# EAGLE schematic Super Skiff Power (EAGLE 8.2.2)
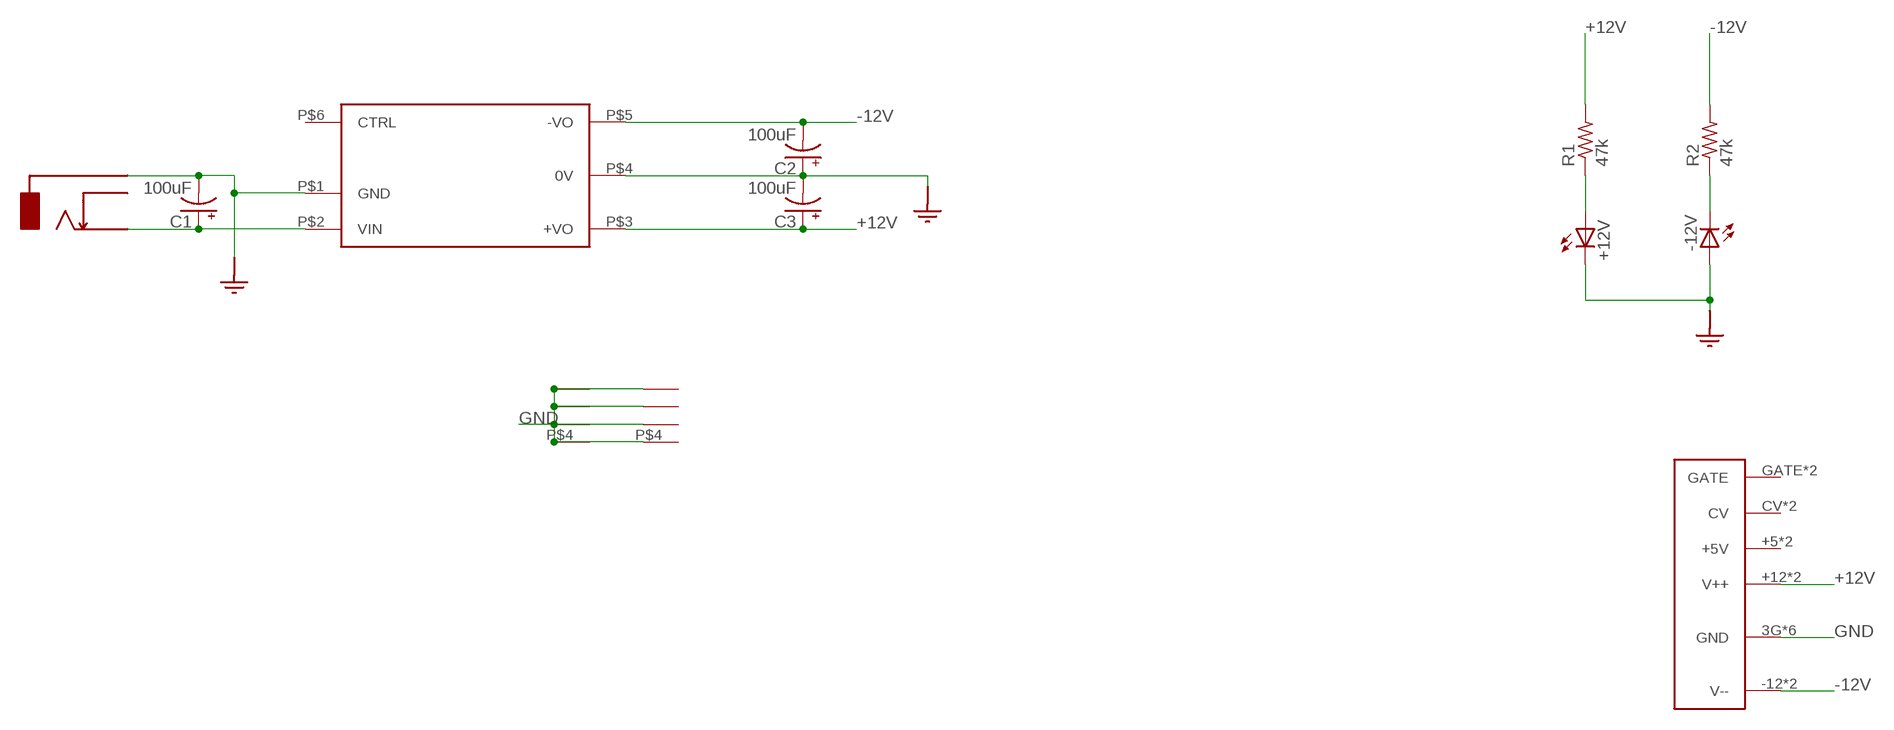
[diagram p0: schematic, sheet 1]

## Parts
+12V  LED5MM  [LED5MM]
-12V  LED5MM  [LED5MM]
C1  100uF  CPOL-USSANYO_D  [SANYO-OSCON_D]
C2  100uF  CPOL-USSANYO_D  [SANYO-OSCON_D]
C3  100uF  CPOL-USSANYO_D  [SANYO-OSCON_D]
R1  47k  R-US_0207/10  [0207/10]
R2  47k  R-US_0207/10  [0207/10]
U$1  URA241XLD-20WR3  [URA241XLD-20WR3]
U$2  DC-POWER  [DC-POWER]
U$3  EURO_POWER_16  [POWER_SHROUDED]
U$6  PCB-2-MOUNTING  [PCB-2-MOUNTING]
U$8  PCB-2-MOUNTING  [PCB-2-MOUNTING]

## Nets
+12V: C3.+ R1.2 U$1.P$3(+VO) U$3.+12(V++) U$3.+12A(V++)
-12V: C2.- R2.2 U$1.P$5(-VO) U$3.-12(V--) U$3.-12A(V--)
GND: +12V.K(C) -12V.A C1.- C2.+ C3.- U$1.P$1(GND) U$1.P$4(0V) U$2.SLEEVEBOT(SLEEVE) U$2.SLEEVETOP(SLEEVE) U$3.3G(GND) U$3.4G(GND) U$3.5G(GND) U$3.6G(GND) U$3.7G(GND) U$3.8G(GND) U$6.P$1 U$6.P$2 U$6.P$3 U$6.P$4 U$8.P$1 U$8.P$2 U$8.P$3 U$8.P$4
N$2: C1.+ U$1.P$2(VIN) U$2.PINBOT(PIN) U$2.PINTOP(PIN)
N$4: +12V.A R1.1
N$5: -12V.K(C) R2.1
Unconnected: U$1.P$6(CTRL) U$2.SWITCHBOT(SWITCH) U$2.SWITCHTOP(SWITCH) U$3.+5(+5V) U$3.+5A(+5V) U$3.CV U$3.CVA(CV) U$3.GATE U$3.GATEA(GATE)

## Library data of the parts
+12V -12V = GMSN:LED: LED OSRAM: - CHIPLED LG R971, LG N971, LY N971, LG Q971, LY Q971, LO R971, LY R971 LH N974, LH R974 LS Q976, LO Q976, LY Q976 LO Q996 - Hyper CHIPLED LW Q18S LB Q993, LB Q99A, LB R99A - SideLED LS A670, LO A670, LY A670, LG A670, LP A670 LB A673, LV A673, LT A673, LW A673 LH A674 LY A675 LS A676, LA A676, LO A676, LY A676, LW A676 LS A679, LY A679, LG A679 - Hyper Micro SIDELED® LS Y876, LA Y876, LO Y876, LY Y876 LT Y87S - SmartLED LW L88C, LW L88S LB L89C, LB L89S, LG L890 LS L89K, LO L89K, LY L89K LS L896, LA L896, LO L896, LY L896 - TOPLED LS T670, LO T670, LY T670, LG T670, LP T670 LSG T670, LSP T670, LSY T670, LOP T670, LYG T670 LG T671, LOG T671, LSG T671 LB T673, LV T673, LT T673, LW T673 LH T674 LS T676, LA T676, LO T676, LY T676, LB T676, LH T676, LSB T676, LW T676 LB T67C, LV T67C, LT T67C, LS T67K, LO T67K, LY T67K, LW E67C LS E67B, LA E67B, LO E67B, LY E67B, LB E67C, LV E67C, LT E67C LW T67C LS T679, LY T679, LG T679 LS T770, LO T770, LY T770, LG T770, LP T770 LB T773, LV T773, LT T773, LW T773 LH T774 LS E675, LA E675, LY E675, LS T675 LS T776, LA T776, LO T776, LY T776, LB T776 LHGB T686 LT T68C, LB T68C - Hyper Mini TOPLED® LB M676 - Mini TOPLED Santana® LG M470 LS M47K, LO M47K, LY M47K Source: http://www.osram.convergy.de/
C1-C3 = GMSN:CPOL-US: POLARIZED CAPACITOR, American symbol
R1 R2 = GMSN:R-US_: RESISTOR, American symbol
U$1 = GMSN:URA241XLD-20WR3
U$2 = GMSN:DC-POWER
U$3 = GMSN:EURO_POWER_16
U$6 U$8 = GMSN:PCB-2-MOUNTING